# EAGLE design BeaconKeyer_RevB (EAGLE 7.6.0)
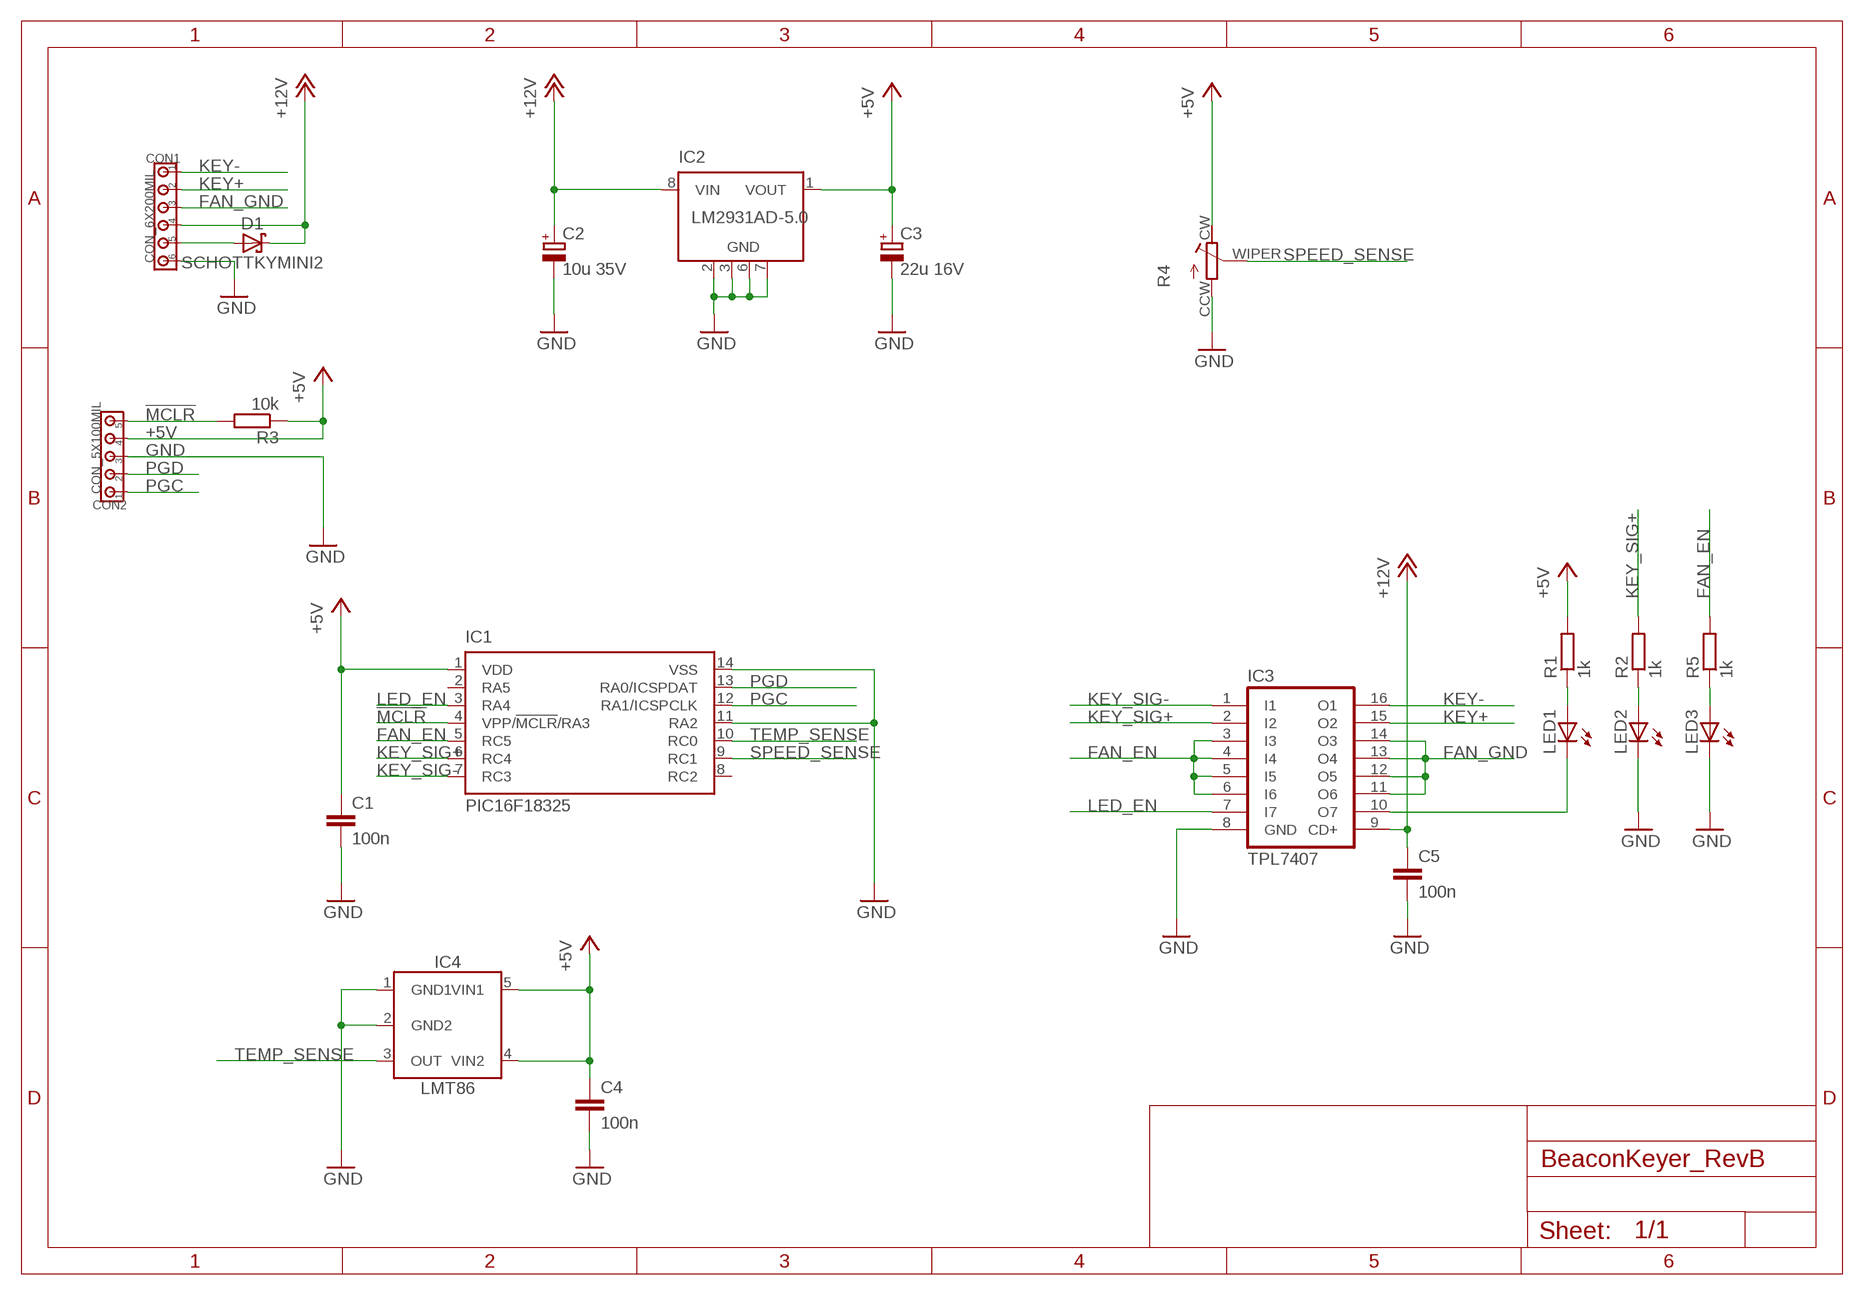
[diagram p0: schematic, sheet 1]

## Parts
C1  100n  CC0805  [C0805]
C2  10u 35V  C_POLARIZEDSMC_C  [SMC_C]
C3  22u 16V  C_POLARIZEDSMC_C  [SMC_C]
C4  100n  CC0805  [C0805]
C5  100n  CC0805  [C0805]
CON1  CON_6X200MIL  [200MIL_6X]
CON2  CON_5X100MIL  [100MIL_5X]
D1  SCHOTTKYMINI2  [MINI2-F3-B]
IC1  PIC16F18325  [SO14]
IC2  LM2931AD-5.0  [SOIC8]
IC3  TPL7407  ULN2003  [SO16]
IC4  LMT86  [SC70-5]
LED1  LED0805  [LED0805]
LED2  LED0805  [LED0805]
LED3  LED0805  [LED0805]
R1  1k  RESISTORR0805  [R0805]
R2  1k  RESISTORR0805  [R0805]
R3  10k  RESISTORR0805  [R0805]
R4  TRIMMER3314G  [RTRIM3314G]
R5  1k  RESISTORR0805  [R0805]

## Nets
!MCLR!: CON2.5 IC1.4(VPP/!MCLR!/RA3) R3.2
+5V: C1.1 C3.+ C4.1 CON2.4 IC1.1(VDD) IC2.1(VOUT) IC4.4(VIN2) IC4.5(VIN1) R1.2 R3.1 R4.CW
+12V: C2.+ C5.1 CON1.4 D1.C IC2.8(VIN) IC3.9(CD+)
FAN_EN: IC1.5(RC5) IC3.3(I3) IC3.4(I4) IC3.5(I5) IC3.6(I6) R5.2
FAN_GND: CON1.3 IC3.11(O6) IC3.12(O5) IC3.13(O4) IC3.14(O3)
GND: C1.2 C2.- C3.- C4.2 C5.2 CON1.6 CON2.3 IC1.11(RA2) IC1.14(VSS) IC2.2(GND) IC2.3(GND) IC2.6(GND) IC2.7(GND) IC3.8(GND) IC4.1(GND1) IC4.2(GND2) LED2.C LED3.C R4.CCW
KEY+: CON1.2 IC3.15(O2)
KEY-: CON1.1 IC3.16(O1)
KEY_SIG+: IC1.6(RC4) IC3.2(I2) R2.2
KEY_SIG-: IC1.7(RC3) IC3.1(I1)
LED_EN: IC1.3(RA4) IC3.7(I7)
N$1: LED2.A R2.1
N$2: LED1.A R1.1
N$4: IC3.10(O7) LED1.C
N$5: LED3.A R5.1
PGC: CON2.1 IC1.12(RA1/ICSPCLK)
PGD: CON2.2 IC1.13(RA0/ICSPDAT)
SPEED_SENSE: IC1.9(RC1) R4.WIPER
TEMP_SENSE: IC1.10(RC0) IC4.3(OUT)
VIN: CON1.5 D1.A
Unconnected: IC1.2(RA5) IC1.8(RC2)

## Library data of the parts
C1 C4 C5 = 00Capacitor:C: Capacitor
C2 C3 = 00Capacitor:C_POLARIZED
CON1 = 00Connector:CON_6X: 6-pin header
CON2 = 00Connector:CON_5X: 5-pin header
D1 = 00Diode:SCHOTTKY
IC1 = 00PIC:PIC16F18325
IC2 = 00VoltageRegulator:LM2931*
IC3 = 00Transistor:ULN2003: Seven Darlington array
IC4 = 00Sensor:LMT86: Analog Temperature Sensors with Class-AB Output
LED1-LED3 = 00Display:LED: LED
R1-R3 R5 = 00Resistor:RESISTOR: RESISTOR, European symbol
R4 = 00Resistor:TRIMMER

## Board
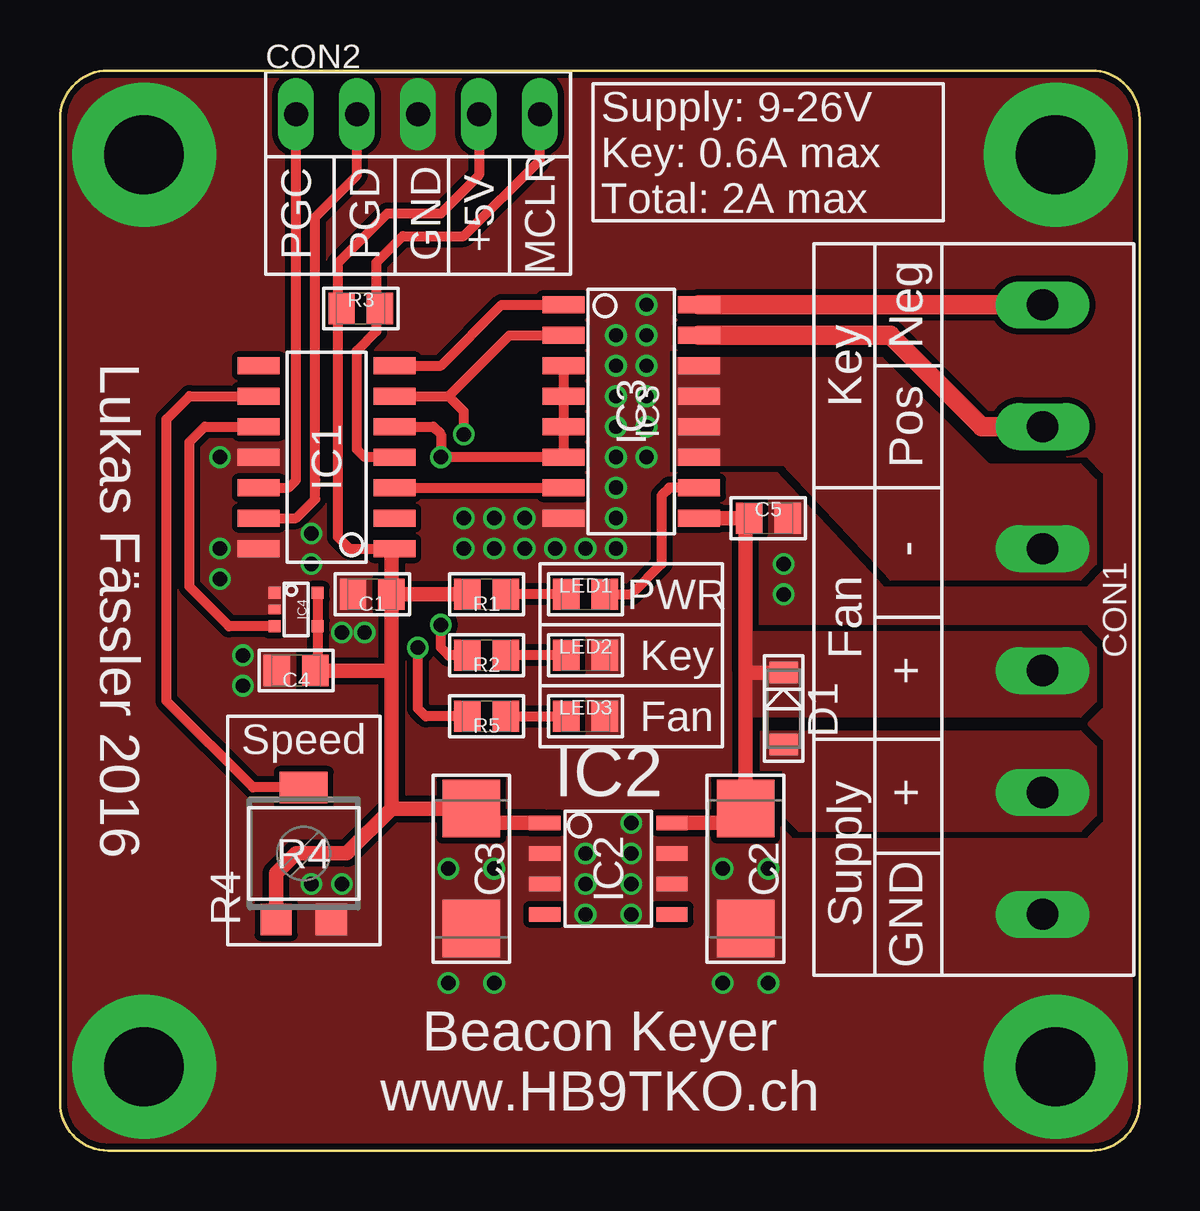
[diagram p1: board, top side]
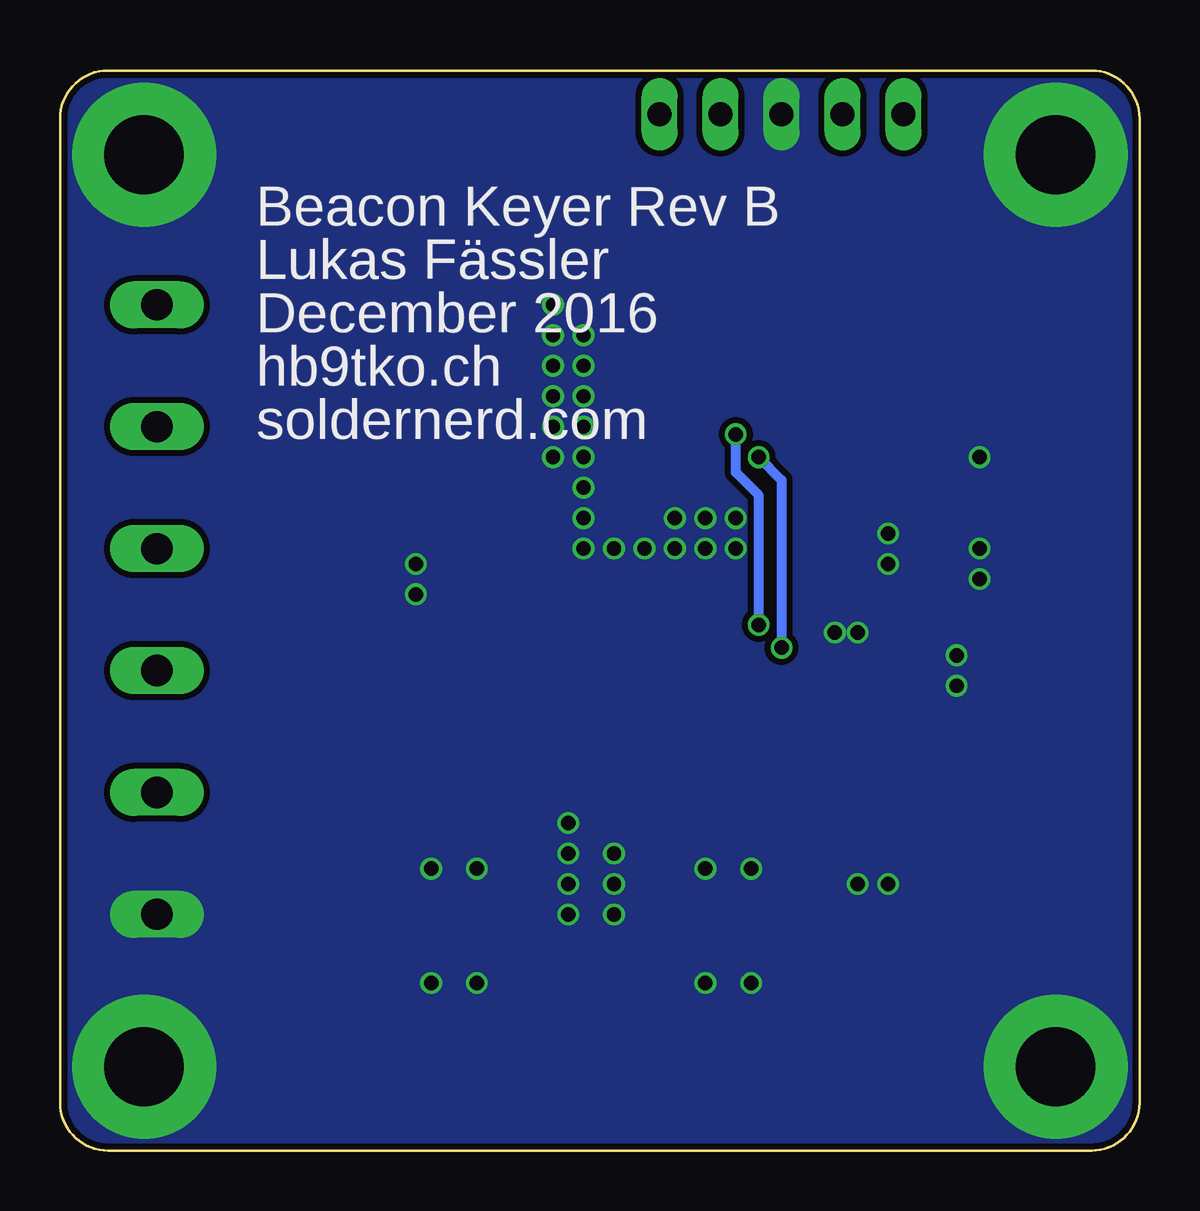
[diagram p2: board, bottom side, seen from below]

Size 45 x 45 mm. Coordinates in mm from the lower left corner, seen from the top.
Outline: 0,43 arc-90 2,45 43,45 arc-90 45,43 45,2 arc-90 43,0 2,0 arc-90 0,2 0,43
Copper layers (1*16): Top 0.035mm / dielectric 1.5mm / Bottom 0.035mm
Design rules "dirt_cheap_dirty_boards.v1 *": minimum track width 5mil, minimum drill 12mil, track to track 8mil, track to pad 8mil, pad to pad 8mil, via to via 8mil, smd to smd 0mil, copper to edge 10mil, drill to drill 10mil, minimum pad ring 10mil, minimum via ring 6mil, stop-mask expansion 2mil, vias tented up to drill 25mil, thermal gap 10mil

### Footprints (pad centres in the part's own frame; a part is rotated, then mirrored left to right if it is on the bottom)
C0805 = smd 1.1 x 1.3: 1 -0.8,0; 2 0.8,0
SMC_C = smd 2.4 x 2.4: + -2.5,0; - 2.5,0
200MIL_6X = drill 1.3 long: 1 -12.7,0; 2 -7.62,0; 3 -2.54,0; 4 2.54,0; 5 7.62,0; 6 12.7,0
100MIL_5X = drill 1 long: 1 -5.08,0; 2 -2.54,0; 3 0,0; 4 2.54,0; 5 5.08,0
MINI2-F3-B = smd 0.9 x 1.2: A 1.5,0; C -1.5,0
SO14 = smd 0.7 x 1.75: 1 -3.81,-2.825; 2 -2.54,-2.825; 3 -1.27,-2.825; 4 0,-2.825; 5 1.27,-2.825; 6 2.54,-2.825; 7 3.81,-2.825; 8 3.81,2.825; 9 2.54,2.825; 10 1.27,2.825; 11 0,2.825; 12 -1.27,2.825; 13 -2.54,2.825; 14 -3.81,2.825
SOIC8 = smd 1.3 x 0.6: 1 -2.65,1.905; 2 -2.65,0.635; 3 -2.65,-0.635; 4 -2.65,-1.905; 5 2.65,-1.905; 6 2.65,-0.635; 7 2.65,0.635; 8 2.65,1.905
SO16 = smd 0.7 x 1.75: 1 -4.445,-2.825; 2 -3.175,-2.825; 3 -1.905,-2.825; 4 -0.635,-2.825; 5 0.635,-2.825; 6 1.905,-2.825; 7 3.175,-2.825; 8 4.445,-2.825; 9 4.445,2.825; 10 3.175,2.825; 11 1.905,2.825; 12 0.635,2.825; 13 -0.635,2.825; 14 -1.905,2.825; 15 -3.175,2.825; 16 -4.445,2.825
SC70-5 = smd 0.5 x 0.5: 1 -0.7,-0.9; 3 0.7,-0.9; 4 0.7,0.9; 5 -0.7,0.9 | smd 0.4 x 0.5: 2 0,-0.9
LED0805 = smd 1.1 x 1.3: A -0.8,0; C 0.8,0
R0805 = smd 1.1 x 1.3: 1 -0.8,0; 2 0.8,0
RTRIM3314G = smd 1.3 x 1.3: CCW 1.15,-2.75; CW -1.15,-2.75 | smd 2 x 1.3: WIPER 0,2.75

### Placement (x,y rotation side)
C1  13.02,23.18 180 top
C2  28.57,11.75 270 top
C3  17.14,11.75 270 top
C4  9.84,20 180 top
C5  29.53,26.35 0 top
CON1  40.96,22.54 270 top
CON2  14.92,43.18 0 top
D1  30.16,18.41 270 top
IC1  11.11,28.89 90 top
IC2  22.86,11.75 0 top
IC3  23.81,30.8 270 top
IC4  9.84,22.54 270 top
LED1  21.91,23.18 0 top
LED2  21.91,20.64 0 top
LED3  21.91,18.1 0 top
R1  17.78,23.18 180 top
R2  17.78,20.64 180 top
R3  12.54,35.08 0 top
R4  10.16,12.38 0 top
R5  17.78,18.1 180 top

### Tracks (layer width: path | path; a pad name or v marks a point on that pad's centre or on a via)
!MCLR!
  Top 0.406: IC1.4 12.7,28.89 12.38,29.21 12.38,33.34 13.18,34.14 13.18,35.24 | CON2.5 20,41.27 16.83,38.1 14.29,38.1 13.18,36.99 13.18,35.24 | 13.18,35.24 R3.2
+5V
  Top 0.406: 17.3,14.4 C3.+ 16.87,13.97 | CON2.4 17.46,40.64 15.88,39.05 13.65,39.05 11.58,36.98 11.58,34.61 | IC4.5 IC4.4 10.74,20.1 C4.1 | 11.58,34.61 11.59,34.61 11.59,25.56 12.06,25.08 IC1.1 13.99,25.03 13.82,25.03 | 11.58,34.61 11.74,34.77 R3.1
  Top 0.61: R4.CW 9.01,11.55 9.84,12.38 11.95,12.38 13.82,14.25 | IC2.1 17.74,13.65 C3.+ 13.82,14.25 | 13.82,25.03 C1.1 | C1.1 13.82,20 | 13.82,20 13.82,14.25 | C1.1 R1.2 | C4.1 13.82,20
+12V
  Top 0.61: 28.57,20 C2.+ 27.98,13.65 IC2.8 | D1.C 28.66,19.91 28.57,20 | 28.57,20 28.57,26.19 C5.1 IC3.9
  Top 0.813: 28.57,14.29 C2.+ | 40.87,19.91 CON1.4
  pour Top (isolate 0.254, no thermals): 42.55,21.59 43.18,20.95 43.18,18.73 42.55,18.1 28.57,18.1 28.57,21.59
FAN_EN  (via drill 0.6)
  Top 0.406: IC3.3 IC3.4 IC3.5 IC3.6 v15.88,28.89 15.88,29.84 15.56,30.16 IC1.5 | R5.2 15.24,18.1 14.92,18.41 v14.92,20.95
  Bottom 0.406: v15.88,28.89 14.92,27.94 v14.92,20.95
FAN_GND
  pour Top (isolate 0.254, rank 2, no thermals): 34.29,33.02 25.72,33.02 25.72,28.57 30.16,28.57 34.61,23.81 42.55,23.81 43.18,24.45 43.18,27.94 42.55,28.57 38.73,28.57
GND  (via drill 0.6, 3.3 pad 6)
  Top 0.813: 28.61,9.21 C2.-
  other vias: 3.5,41.5 41.5,41.5 41.5,3.5 3.5,3.5 23.18,31.43 24.45,32.7 18.1,25.08 19.37,25.08 24.45,31.43 23.18,30.16 16.83,26.35 16.83,25.08 24.45,30.16 24.45,33.97 23.18,32.7 23.18,33.97 12.7,21.59 11.75,21.59 10.48,25.72 30.16,24.45 7.62,20.64 7.62,19.37 16.19,6.99 16.19,11.75 18.1,6.99 18.1,11.75 29.53,11.75 27.62,11.75 23.81,13.65 21.91,12.38 23.81,12.38 21.91,11.11 23.81,11.11 21.91,9.84 23.81,9.84 6.67,28.89 10.48,24.45 6.67,23.81 30.16,23.18 24.45,35.24 20.64,25.08 6.67,25.08 27.62,6.99 29.53,6.99 23.18,28.89 24.45,28.89 23.18,27.62 23.18,26.35 19.37,26.35 18.1,26.35 11.75,11.11 10.48,11.11 23.18,25.08 21.91,25.08
  pour Bottom (isolate 0.254, rank 2, no thermals): 0,30 0,43 arc-90 2,45 20,45 43,45 arc-90 45,43 45,25 45,2 arc-90 43,0 25,0 2,0 arc-90 0,2
  pour Top (isolate 0.254, rank 4, no thermals): 0,20 0,43 arc-90 2,45 25,45 43,45 arc-90 45,43 45,15 45,2 arc-90 43,0 25,0 2,0 arc-90 0,2
KEY+
  Top 0.813: IC3.15 34.61,33.97 38.42,30.16 CON1.2
KEY-
  Top 0.813: IC3.16 CON1.1
KEY_SIG+  (via drill 0.6)
  Top 0.406: IC1.6 16.19,31.43 | 16.19,31.43 18.73,33.97 IC3.2 | R2.2 16.19,20.64 15.88,20.95 v15.88,21.91 | 16.19,31.43 16.83,30.8 v16.83,29.84
  Bottom 0.406: v15.88,21.91 15.88,27.3 16.83,28.26 v16.83,29.84
KEY_SIG-
  Top 0.406: IC1.7 15.88,32.7 18.41,35.24 IC3.1
LED_EN
  Top 0.406: IC1.3 IC3.7
N$1
  Top 0.406: LED2.A R2.1
N$2
  Top 0.406: LED1.A R1.1
N$4
  Top 0.406: LED1.C 23.81,23.18 25.08,24.45 25.08,27.3 25.4,27.62 IC3.10
N$5
  Top 0.406: R5.1 LED3.A
PGC
  Top 0.406: IC1.12 9.53,27.62 9.84,27.94 CON2.1
PGD
  Top 0.406: IC1.13 9.84,26.35 10.64,27.15 10.64,27.62 10.64,27.94 10.64,38.89 12.38,40.64 CON2.2
SPEED_SENSE
  Top 0.406: IC1.9 5.4,31.43 4.45,30.48 4.45,18.73 8.04,15.13 R4.WIPER
TEMP_SENSE
  Top 0.406: IC1.10 6.03,30.16 5.4,29.53 5.4,23.5 7.05,21.84 IC4.3
VIN
  pour Top (isolate 0.254, no thermals): 42.55,17.46 43.18,16.83 43.18,13.97 42.55,13.34 30.8,13.34 30.16,13.97 30.16,15.88 29.21,15.88 29.21,17.46

### Text on the board
tPlace: Supply: 9-26V | Key: 0.6A max | Total: 2A max | PGC | PGD | GND | +5V | MCLR | Neg | Key | Pos | - | PWR | Lukas Fässler 2016 | Fan | Key | + | Fan | Speed | + | Supply | GND | Beacon Keyer | www.HB9TKO.ch
bPlace: Beacon Keyer Rev B | Lukas Fässler | December 2016 | hb9tko.ch | soldernerd.com